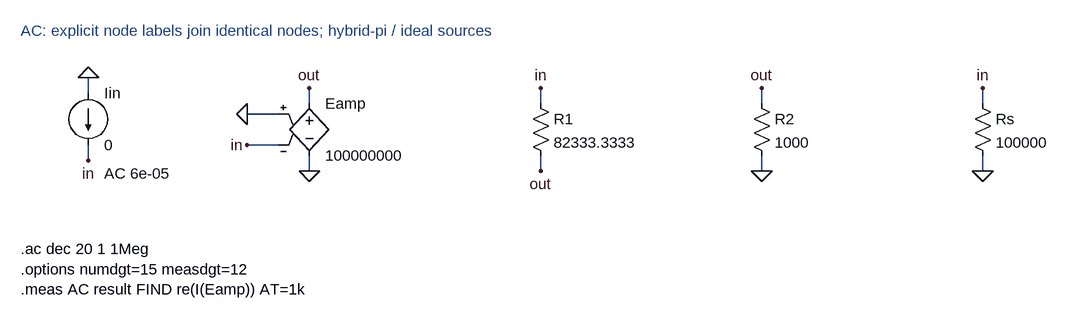
[diagram p0: schematic AC.asc]
AC.asc, the LTspice schematic file:
Version 4
SHEET 1 1800 1500
TEXT 16 -48 Left 2 ;AC: explicit node labels join identical nodes; hybrid-pi / ideal sources
WIRE 120 48 120 24
FLAG 120 24 0
WIRE 120 128 120 152
FLAG 120 152 in
SYMBOL current 120 48 R0
SYMATTR InstName Iin
WINDOW 123 24 124 Left 2
SYMATTR Value 0
SYMATTR Value2 AC 6e-05
WIRE 460 64 460 40
FLAG 460 40 out
WIRE 460 144 460 168
FLAG 460 168 0
WIRE 412 80 364 80
FLAG 364 80 0
WIRE 412 128 364 128
FLAG 364 128 in
SYMBOL e 460 48 R0
SYMATTR InstName Eamp
SYMATTR Value 100000000
WIRE 816 64 816 40
FLAG 816 40 in
WIRE 816 144 816 168
FLAG 816 168 out
SYMBOL res 800 48 R0
SYMATTR InstName R1
SYMATTR Value 82333.3333
WIRE 1156 64 1156 40
FLAG 1156 40 out
WIRE 1156 144 1156 168
FLAG 1156 168 0
SYMBOL res 1140 48 R0
SYMATTR InstName R2
SYMATTR Value 1000
WIRE 1496 64 1496 40
FLAG 1496 40 in
WIRE 1496 144 1496 168
FLAG 1496 168 0
SYMBOL res 1480 48 R0
SYMATTR InstName Rs
SYMATTR Value 100000
TEXT 16 288 Left 2 !.ac dec 20 1 1Meg\n.options numdgt=15 measdgt=12\n.meas AC result FIND re(I(Eamp)) AT=1k

The netlist it stands for:
* AC.asc
Iin 0 in 0 AC 6e-05
Eamp out 0 0 in 100000000
R1 in out 82333.3333
R2 out 0 1000
Rs in 0 100000
* AC: explicit node labels join identical nodes; hybrid-pi / ideal sources
.ac dec 20 1 1Meg
.options numdgt=15 measdgt=12
.meas AC result FIND re(I(Eamp)) AT=1k
.backanno
.end

* Results of the author's LTspice run, read from the files saved beside the schematic
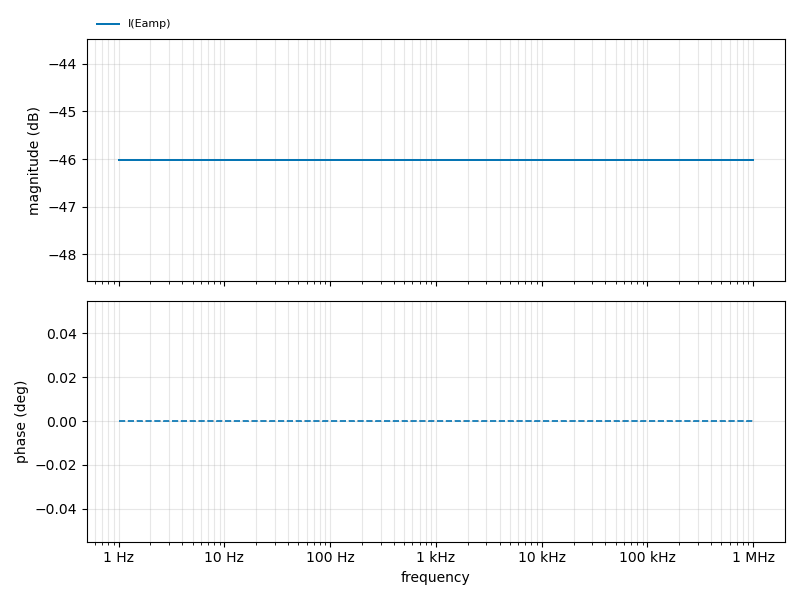
[diagram p1: AC Analysis of AC.asc, plotted from the saved traces]
* AC Analysis, 1 run:
*   I(Eamp): -46.02 dB at 1 Hz, -46.02 dB at 1 MHz, peak -46.02 dB at 1 Hz
* From the log:
*   result: re(I(Eamp))=(-46.0206000741dB,0°) at 1000